# EasyEDA schematic SCH_Line follower_2022-11-20 (1).json
TITLE: Line follower - elektrisch schema; REV: 1.0; Date: 2022-10-13; Sheet: 1/1; Drawn By: Kilian De Ruyck; Company: Hogeschool Gent
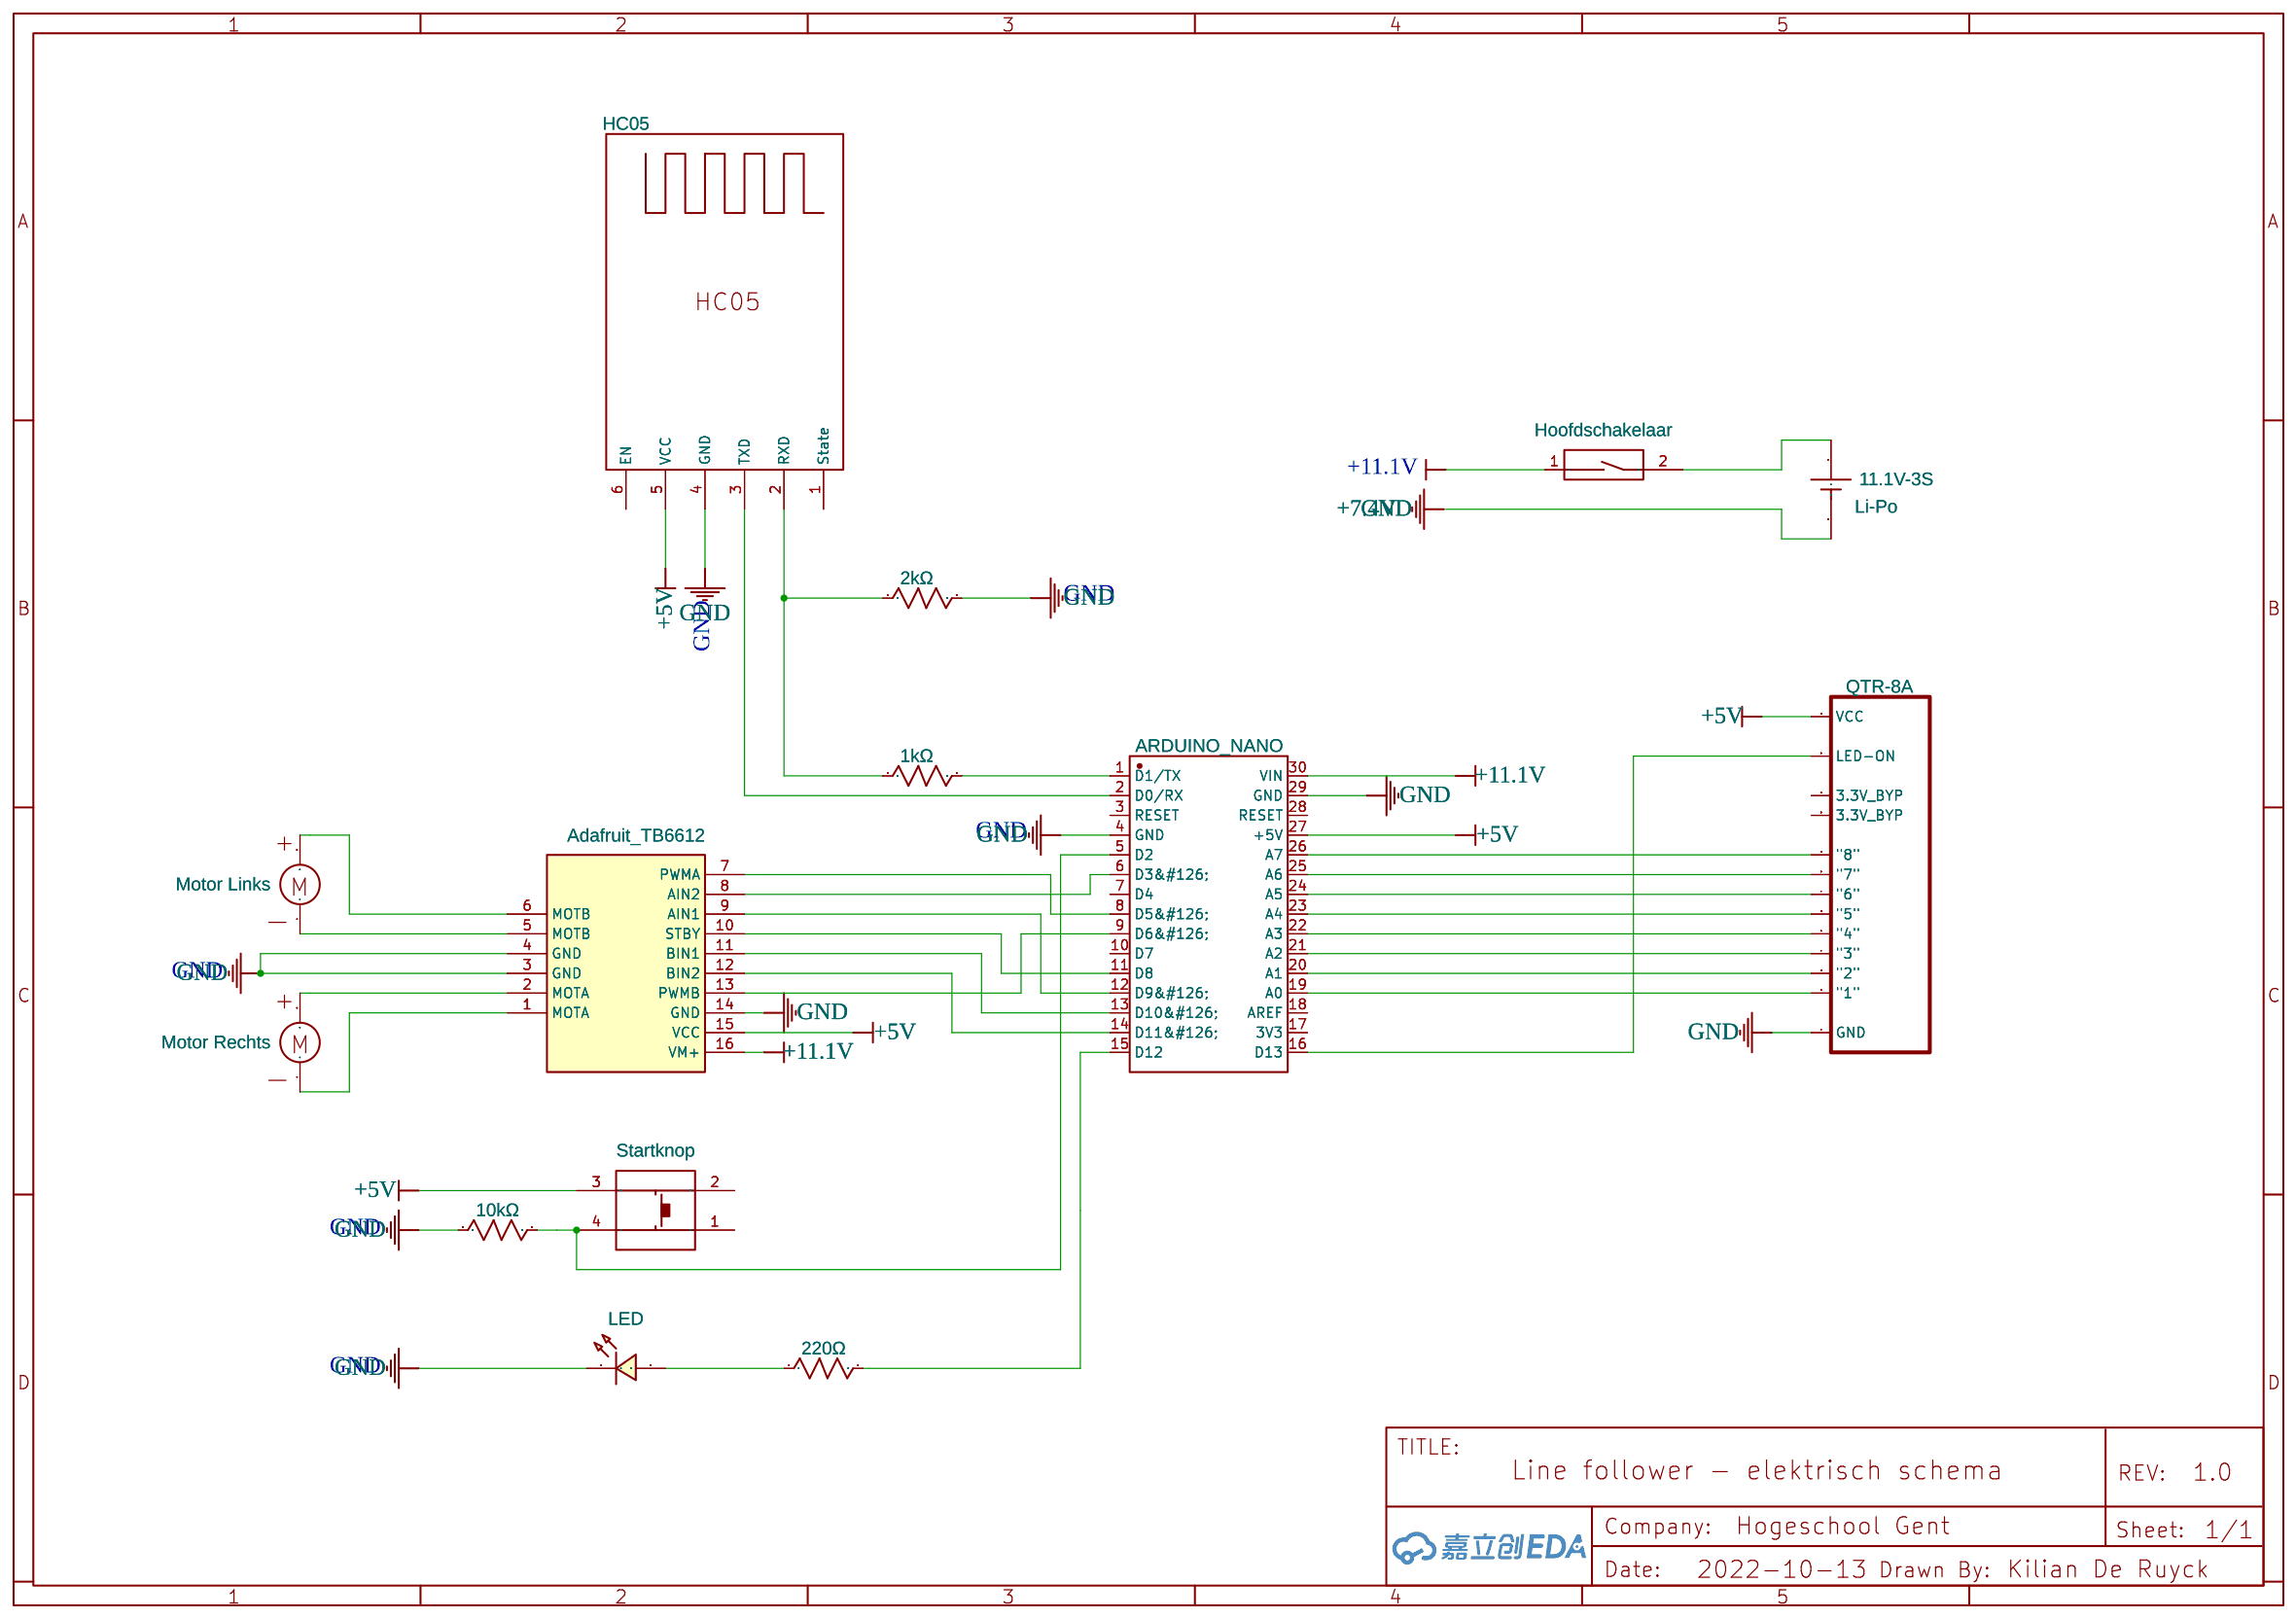
[diagram p0: schematic sheet]

## Parts
11.1V-3S  Li-Po  [LIPO]
DIP1  Hoofdschakelaar  [DIP SWITCH 6 SWITCHES]
K1  Startknop  [PUSHBUTTON]
LED  LED-0603_R  [LED0603_RED]
R1  220Ω  [R0603]
R2  10kΩ  [R0603]
R3  2kΩ  [R0603]
R4  1kΩ  [R0603]
U1  ARDUINO_NANO  [COMM-TH_ARDUINO_NANO]
U2  Adafruit_TB6612  [ADAFRUIT TB6612]
U3  HC05  [HM-10/HC-05-PCB-ABHI]
U4  QTR-8A  [QTR-8A/8RC]
U8  Motor Rechts  [TT DC MOTOR]
U9  Motor Links  [TT DC MOTOR]

## Library data of the parts
11.1V-3S = Li-Po: Contributor: junlakan67
DIP1 = SWITCH: Manufacturer: DIP; Manufacturer Part: DIP switchEI-08; Supplier Part: C90019; Contributor: s6104031620126; libConvert: Yes; Add into BOM: Yes
K1 = Pushbutton: Contributor: kaminskim; sourceId: awqkBTbHn; Supplier: MrokNocy
LED = LED-0603_R: Manufacturer: EVERLIGHT(台湾亿光); Manufacturer Part: 19-217/R6C-AL1M2VY/3T; Supplier Part: C72044; Supplier: LCSC; Contributor: LCEDA_01
R1-R4 = R_0603_US: Contributor: LCEDA_Lib
U1 = ARDUINO_NANO: Supplier: LCSC; Supplier Part: C9900017879; Manufacturer: null; JLCPCB Part Class: Extended Part; Contributor: lcsc
U2 = Adafruit_TB6612: Manufacturer Part: 2448; Contributor: kilianderuyck; Supplier Part: 485-2448; Supplier: Mouser; link: https://cdn-learn.adafruit.com/downloads/pdf/adafruit-tb6612-h-bridge-dc-stepper-motor-driver-breakout.pdf
U3 = HC05/HM10-Abhi: Contributor: undefined.abhinav19
U4 = QTR-8A: Manufacturer: Pololu; Supplier: Pololu; Supplier Part: 960; link: https://www.pololu.com/docs/pdf/0J12/QTR-8x.pdf; Contributor: Junikos
U8 U9 = DC Motor: Contributor: MARTINbucke

## Nets
+5V: K1.3 U1.16(D13) U1.27(+5V) U2.15(VCC) U3.5(VCC) U4.12(LED-ON)
+7.4V: DIP1.1
+11.1V: U1.30(VIN) U2.16(VM+)
GND: 11.1V-3S.2 LED.2 R2.1 R3.2 U1.4(GND) U1.29(GND) U2.3(GND) U2.4(GND) U2.14(GND) U3.4(GND) U4.1(GND)
Net-(11.1V-3S-1): 11.1V-3S.1 DIP1.2
Net-(K1-4): K1.4 R2.2 U1.5(D2)
Net-(LED-1): LED.1 R1.1
Net-(R1-2): R1.2 U1.15(D12)
Net-(R3-1): R3.1 R4.1 U3.2(RXD)
Net-(R4-2): R4.2 U1.1(D1/TX)
Net-(U1-2): U1.2(D0/RX) U3.3(TXD)
Net-(U1-6): U1.6(D3&#126;) U2.8(AIN2)
Net-(U1-8): U1.8(D5&#126;) U2.7(PWMA)
Net-(U1-9): U1.9(D6&#126;) U2.13(PWMB)
Net-(U1-11): U1.11(D8) U2.10(STBY)
Net-(U1-12): U1.12(D9&#126;) U2.9(AIN1)
Net-(U1-13): U1.13(D10&#126;) U2.11(BIN1)
Net-(U1-14): U1.14(D11&#126;) U2.12(BIN2)
Net-(U1-19): U1.19(A0) U4.2("1")
Net-(U1-20): U1.20(A1) U4.3("2")
Net-(U1-21): U1.21(A2) U4.4("3")
Net-(U1-22): U1.22(A3) U4.5("4")
Net-(U1-23): U1.23(A4) U4.6("5")
Net-(U1-24): U1.24(A5) U4.7("6")
Net-(U1-25): U1.25(A6) U4.8("7")
Net-(U1-26): U1.26(A7) U4.9("8")
Net-(U2-1): U2.1(MOTA) U8.1
Net-(U2-2): U2.2(MOTA) U8.2
Net-(U2-5): U2.5(MOTB) U9.1
Net-(U2-6): U2.6(MOTB) U9.2

Not connected (* = marked no-connect by the designer): K1 1 2; U1 3(RESET) 7(D4) 10(D7) 17(3V3) 18(AREF) 28(RESET); U3 1(State) 6(EN); U4 10(3.3V BYP) 11(3.3V BYP)

## Notes on the sheet
- +11.1V
- GND
- GND
- GND
- GND
- GND
- GND
